# Altium schematic sheet oscillator-25MHz.SchDoc
size A3; DocumentNumber: 30; SheetNumber: 30; SheetTotal: 45; SheetDescription: Oscillator
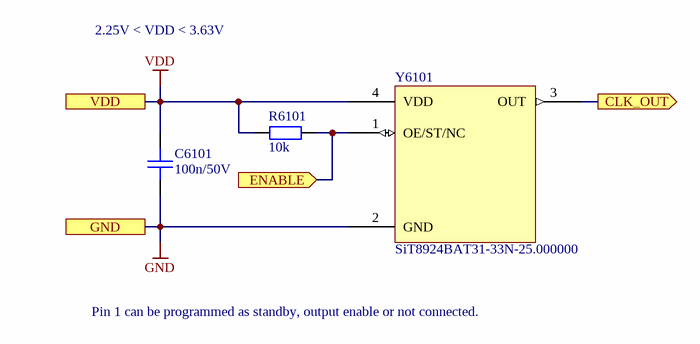
[diagram p0: oscillator-25MHz.SchDoc]

## Parts
C6101  100n/50V  [CAPC1005X06N]
R6101  10k  [RESC1005X04N]
Y6101  SiT8924BAT31-33N-25.000000  [SiT8924xx-3x]

## Ports
CLK_OUT (out), ENABLE (in), GND, VDD

## Nets
GND: C6101.1 Y6101.2(GND) ; port GND
VDD: C6101.2 R6101.1 Y6101.4(VDD) ; port VDD
CLK_OUT: Y6101.3(OUT) ; port CLK_OUT
ENABLE: R6101.2 Y6101.1(OE/ST/NC) ; port ENABLE

## Notes on the sheet
- 2.25V < VDD < 3.63V
- Pin 1 can be programmed as standby, output enable or not connected.
- Fraunhofer IISB
- Schottkystr. 10
- developed by:
- 91058 Erlangen
- Germany
- Author
- Project
- License
- Description
- File
- Version
- Release Date
- Sheet
- foxbms.org <https://foxbms.org>
- www.iisb.fraunhofer.de <https://www.iisb.fraunhofer.de/>
- foxBMS Team
- /

## Library data of the parts
C6101 = gen_C_ceramic_100n_50V_X7R_0402: MLCC; Capacitance: 100n; Rated Voltage: 50V; Dielectric: X7R; Case EIA: 0402; Case Metric: 1005; PnP Package: 0402C; PnP Value: 100nF/50V/X7R; PnP equipped: x; Automotive Qualified: True; AEC-Q Norm: AEC-Q200; Part Number: gen_C_ceramic_100n_50V_X7R_0402; Supplier 1: Farnell; Supplier Part Number 1: 2210822; ECCN: EAR99
R6101 = gen_R_10k_0402: SMD Resistor 10k 0402; Tolerance: 1%; Power: 0.063W; Case EIA: 0402; Case Metric: 1005; Maximum Working Voltage: 50V; PnP Package: 0402R; PnP equipped: x; Automotive Qualified: True; AEC-Q Norm: AEC-Q200; Part Number: gen_R_10k_0402; Operating Temperature: -55°C - +155°C; Resistance: 10k; Series: E24, E96; PnP Value: 10k; Supplier 1: Farnell; Supplier Part Number 1: 2059239; ECCN: EAR99
Y6101 = SiT8924BAT31-33N-25.000000: Automotive AEC-Q100 Oscillator 25MHz; Manufacturer: SiTime; Automotive Qualified: True; AEC-Q Grade: Grade 0; Part Number: SiT8924BAT31-33N-25.000000; Part Name: SiT8924BAT31-33N-25.000000; Operating Temperature: -55°C - +125°C; ComponentLink1Description: Datasheet; ComponentLink1URL: https://www.sitime.com/datasheet/SiT8924; AEC-Q Norm: AEC-Q100; ECCN: EAR99